# EAGLE schematic SM (EAGLE 5.11)
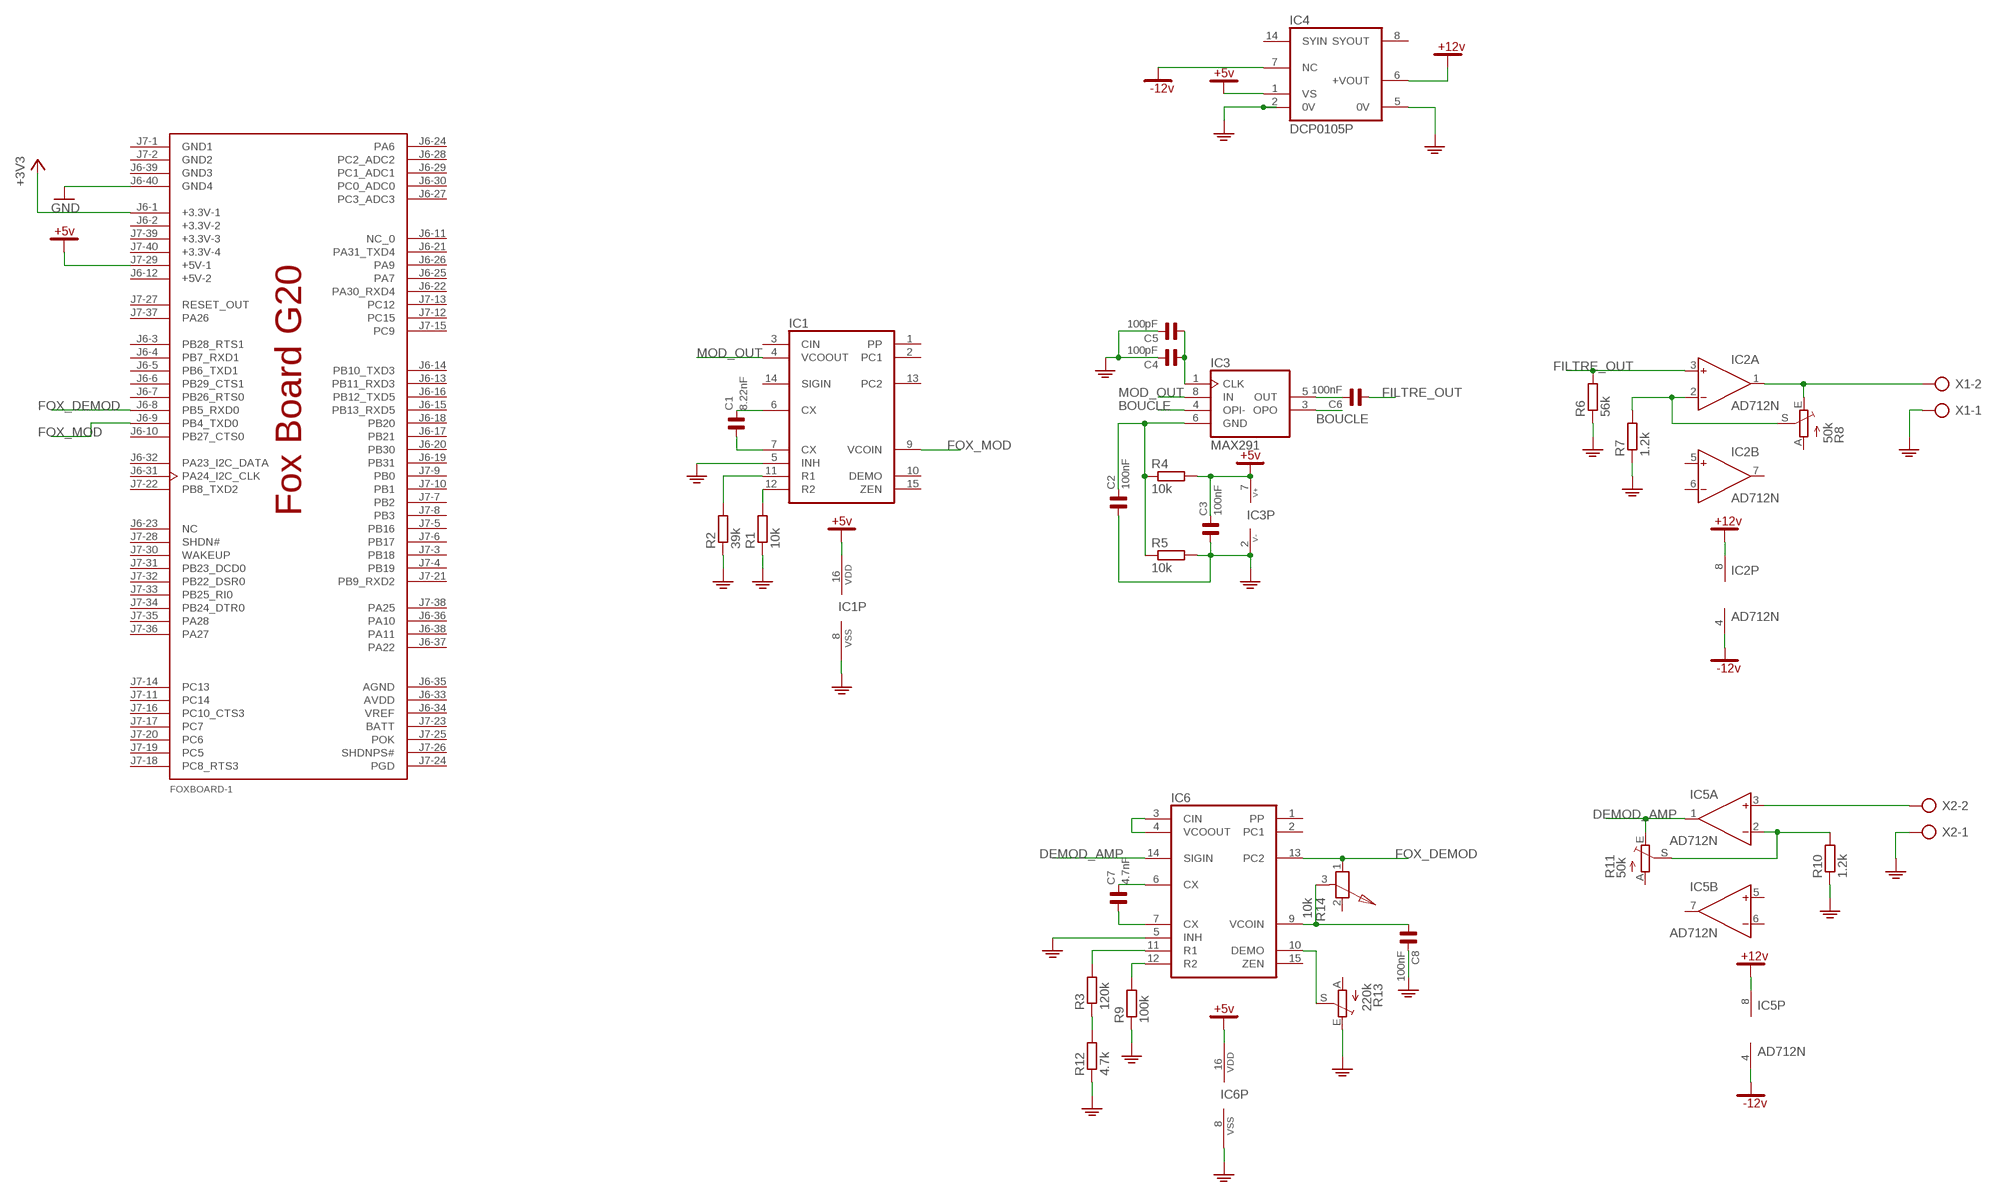
[diagram p0: schematic, sheet 1]

## Parts
C1  8.22nF  C5B2,5  [C5B2,5]
C2  100nF  C7,5B4  [C7,5B4]
C3  100nF  C7,5B4  [C7,5B4]
C4  100pF  C5B2,5  [C5B2,5]
C5  100pF  C5B2,5  [C5B2,5]
C6  100nF  C7,5B4  [C7,5B4]
C7  4.7nF  C5B2,5  [C5B2,5]
C8  100nF  C7,5B4  [C7,5B4]
FOXBOARD-1  FOX-BOARD  [FOX-BOARD]
IC1  4046  [DIL16]
IC2  AD712N  [DIL08]
IC3  MAX291  [DIL08]
IC4  DCP0105P  [DIL14/7]
IC5  AD712N  [DIL08]
IC6  4046  [DIL16]
R1  10k  R-EU_0309/12  [0309/12]
R2  39k  R-EU_0309/12  [0309/12]
R3  120k  R-EU_0309/12  [0309/12]
R4  10k  R-EU_0309/12  [0309/12]
R5  10k  R-EU_0309/12  [0309/12]
R6  56k  R-EU_0309/12  [0309/12]
R7  1.2k  R-EU_0309/12  [0309/12]
R8  50k  TRIM_EU-B90P  [SP19L]
R9  100k  R-EU_0309/12  [0309/12]
R10  1.2k  R-EU_0309/12  [0309/12]
R11  50k  TRIM_EU-B90P  [SP19L]
R12  4.7k  R-EU_0309/12  [0309/12]
R13  220k  TRIM_EU-B90P  [SP19L]
R14  10k  POT-L  [PT-10]
X1  AK300/2  [AK300/2]
X2  AK300/2  [AK300/2]

## Nets
+3V3: FOXBOARD-1.J6-1(+3.3V-1)
+5V: C3.2 FOXBOARD-1.J7-29(+5V-1) IC1.16(VDD) IC3.7(V+) IC4.1(VS) IC6.16(VDD) R4.2
+12V: IC2.8(P:V+) IC4.6(+VOUT) IC5.8(P:V+)
-12V: IC2.4(P:V-) IC4.7(NC) IC5.4(P:V-)
BOUCLE: IC3.3(OPO) IC3.4(OPI-)
DEMOD_AMP: IC5.1(A:OUT) IC6.14(SIGIN) R11.E
FILTRE_OUT: C6.1 IC2.3(A:IN+) R6.2
FOX_DEMOD: FOXBOARD-1.J6-8(PB5_RXD0) IC6.13(PC2) R14.1
FOX_MOD: FOXBOARD-1.J6-9(PB4_TXD0) IC1.9(VCOIN)
GND: C2.1 C3.1 C4.2 C5.2 C8.2 FOXBOARD-1.J6-40(GND4) IC1.5(INH) IC1.8(VSS) IC3.2(V-) IC4.2(0V) IC4.5(0V) IC6.5(INH) IC6.8(VSS) R1.1 R2.1 R5.2 R6.1 R7.1 R9.1 R10.1 R12.1 R13.E X1.1 X2.1
MOD_OUT: IC1.4(VCOOUT) IC3.8(IN)
N$1: C1.2 IC1.6(CX)
N$2: C1.1 IC1.7(CX)
N$3: IC1.12(R2) R1.2
N$4: IC1.11(R1) R2.2
N$5: IC6.12(R2) R9.2
N$6: C6.2 IC3.5(OUT)
N$7: C2.2 IC3.6(GND) R4.1 R5.1
N$9: C4.1 C5.1 IC3.1(CLK)
N$10: IC2.2(A:IN-) R7.2 R8.S
N$11: IC2.1(A:OUT) R8.E X1.2
N$12: IC5.3(A:IN+) X2.2
N$13: IC6.3(CIN) IC6.4(VCOOUT)
N$14: IC5.2(A:IN-) R10.2 R11.S
N$15: C7.2 IC6.6(CX)
N$16: C7.1 IC6.7(CX)
N$17: IC6.11(R1) R3.2
N$18: R3.1 R12.2
N$19: IC6.10(DEMO) R13.S
N$21: C8.1 IC6.9(VCOIN) R14.3
Unconnected: FOXBOARD-1.J6-3(PB28_RTS1) FOXBOARD-1.J6-4(PB7_RXD1) FOXBOARD-1.J6-5(PB6_TXD1) FOXBOARD-1.J6-6(PB29_CTS1) FOXBOARD-1.J6-7(PB26_RTS0) FOXBOARD-1.J6-10(PB27_CTS0) FOXBOARD-1.J6-11(NC_0) FOXBOARD-1.J6-13(PB11_RXD3) FOXBOARD-1.J6-14(PB10_TXD3) FOXBOARD-1.J6-15(PB13_RXD5) FOXBOARD-1.J6-16(PB12_TXD5) FOXBOARD-1.J6-17(PB21) FOXBOARD-1.J6-18(PB20) FOXBOARD-1.J6-19(PB31) FOXBOARD-1.J6-20(PB30) FOXBOARD-1.J6-21(PA31_TXD4) FOXBOARD-1.J6-22(PA30_RXD4) FOXBOARD-1.J6-23(NC) FOXBOARD-1.J6-24(PA6) FOXBOARD-1.J6-25(PA7) FOXBOARD-1.J6-26(PA9) FOXBOARD-1.J6-27(PC3_ADC3) FOXBOARD-1.J6-28(PC2_ADC2) FOXBOARD-1.J6-29(PC1_ADC1) FOXBOARD-1.J6-30(PC0_ADC0) FOXBOARD-1.J6-31(PA24_I2C_CLK) FOXBOARD-1.J6-32(PA23_I2C_DATA) FOXBOARD-1.J6-33(AVDD) FOXBOARD-1.J6-34(VREF) FOXBOARD-1.J6-35(AGND) FOXBOARD-1.J6-36(PA10) FOXBOARD-1.J6-37(PA22) FOXBOARD-1.J6-38(PA11) FOXBOARD-1.J7-3(PB18) FOXBOARD-1.J7-4(PB19) FOXBOARD-1.J7-5(PB16) FOXBOARD-1.J7-6(PB17) FOXBOARD-1.J7-7(PB2) FOXBOARD-1.J7-8(PB3) FOXBOARD-1.J7-9(PB0) FOXBOARD-1.J7-10(PB1) FOXBOARD-1.J7-11(PC14) FOXBOARD-1.J7-12(PC15) FOXBOARD-1.J7-13(PC12) FOXBOARD-1.J7-14(PC13) FOXBOARD-1.J7-15(PC9) FOXBOARD-1.J7-16(PC10_CTS3) FOXBOARD-1.J7-17(PC7) FOXBOARD-1.J7-18(PC8_RTS3) FOXBOARD-1.J7-19(PC5) FOXBOARD-1.J7-20(PC6) FOXBOARD-1.J7-21(PB9_RXD2) FOXBOARD-1.J7-22(PB8_TXD2) FOXBOARD-1.J7-23(BATT) FOXBOARD-1.J7-24(PGD) FOXBOARD-1.J7-25(POK) FOXBOARD-1.J7-26(SHDNPS#) FOXBOARD-1.J7-27(RESET_OUT) FOXBOARD-1.J7-28(SHDN#) FOXBOARD-1.J7-30(WAKEUP) FOXBOARD-1.J7-31(PB23_DCD0) FOXBOARD-1.J7-32(PB22_DSR0) FOXBOARD-1.J7-33(PB25_RI0) FOXBOARD-1.J7-34(PB24_DTR0) FOXBOARD-1.J7-35(PA28) FOXBOARD-1.J7-36(PA27) FOXBOARD-1.J7-37(PA26) FOXBOARD-1.J7-38(PA25) IC1.1(PP) IC1.2(PC1) IC1.3(CIN) IC1.10(DEMO) IC1.13(PC2) IC1.14(SIGIN) IC1.15(ZEN) IC2.5(B:IN+) IC2.6(B:IN-) IC2.7(B:OUT) IC4.8(SYOUT) IC4.14(SYIN) IC5.5(B:IN+) IC5.6(B:IN-) IC5.7(B:OUT) IC6.1(PP) IC6.2(PC1) IC6.15(ZEN) R8.A R11.A R13.A R14.2

## Power pins joined to a net without a drawn wire
+3.3V-2: FOXBOARD-1.J6-2(+3.3V-2)
+3.3V-3: FOXBOARD-1.J7-39(+3.3V-3)
+3.3V-4: FOXBOARD-1.J7-40(+3.3V-4)
+5V-2: FOXBOARD-1.J6-12(+5V-2)
GND1: FOXBOARD-1.J7-1(GND1)
GND2: FOXBOARD-1.J7-2(GND2)
GND3: FOXBOARD-1.J6-39(GND3)

## Library data of the parts
C1 C4 C5 C7 = CAP:C5B2,5
C2 C3 C6 C8 = CAP:C7,5B4
FOXBOARD-1 = Julien:FOX-BOARD
IC1 IC6 = 40XX:4046
IC2 IC5 = analog-devices:AD712: Dual Precision, Low Cost, High Speed BiFET Op Amp Source: http://www.analog.com/static/imported-files/data_sheets/AD712.pdf; MF: ALTERA CORPORATION; MPN: AD712JNZ; OC_FARNELL: 9604898; OC_NEWARK: 59K4554
IC3 = maxim:MAX291: DIGITAL FILTER; MPN: MAX291CPA+; OC_FARNELL: unknown; OC_NEWARK: 67K4526
IC4 = burr-brown:DCP0105: DC/DC Converters Miniature 5V Input, 1W Isolated Unregulated; MPN: DCP010512BP-U; OC_FARNELL: 1461015; OC_NEWARK: 61M5777
R1-R7 R9 R10 R12 = rcl:R-EU_: RESISTOR, European symbol
R8 R11 R13 = pot:TRIM_EU-: POTENTIOMETER
R14 = DISCRETE:POT-L
X1 X2 = con-ptr500:AK300/2: CONNECTOR; OC_FARNELL: unknown; OC_NEWARK: unknown